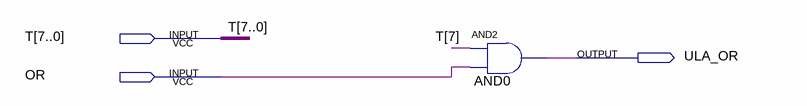
[diagram p0: schematic sheet]
// Quartus schematic ULA_OR.bdf as structural Verilog: 1 symbols, 3 pins
module ULA_OR (
  input  [7:0] T,
  input  OR,
  output ULA_OR
);

  and AND0 (ULA_OR, T[7], OR);
endmodule
